# EAGLE design PowerMeasurement (EAGLE 8.2.2)
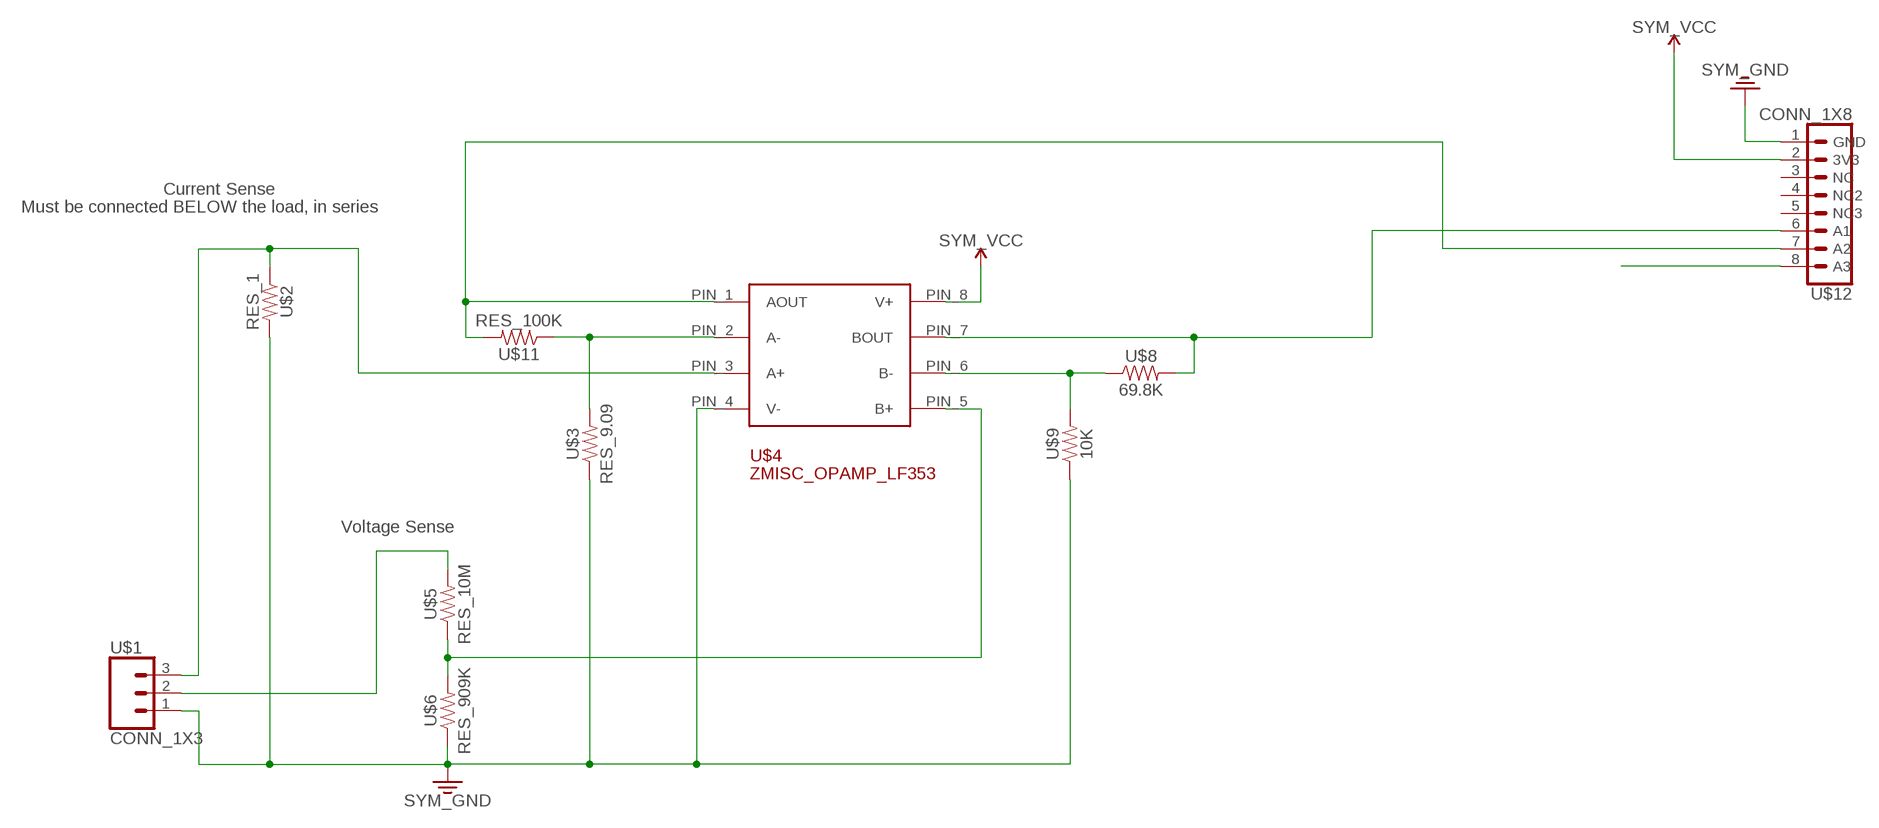
[diagram p0: schematic, sheet 1]

## Parts
U$1  CONN_1X3  [1X03]
U$2  RES_1  [SMD_2512]
U$3  RES_9.09  [SMD_0603]
U$4  ZMISC_OPAMP_LF353  [SOIC-8]
U$5  RES_10M  [SMD_1206]
U$6  RES_909K  [SMD_0805]
U$8  69.8K  RES_69.8K  [SMD_0603]
U$9  10K  RES_10K  [SMD_0603]
U$11  RES_100K  [SMD_0603]
U$12  CONN_1X8  [1X08_LOCK]

## Nets
GND: U$1.1 U$2.P$2 U$3.P$1 U$4.PIN_4(V-) U$6.P$1 U$9.P$1 U$12.1(GND) ; supply symbol labelled SYM_GND
N$1: U$1.3 U$2.P$1 U$4.PIN_3(A+)
N$2: U$12.8(A3)
N$3: U$4.PIN_6(B-) U$8.P$1 U$9.P$2
N$4: U$1.2 U$5.P$2
N$5: U$4.PIN_5(B+) U$5.P$1 U$6.P$2
N$6: U$3.P$2 U$4.PIN_2(A-) U$11.P$1
SCALED_CURRENT_OUT: U$4.PIN_1(AOUT) U$11.P$2 U$12.7(A2)
SCALED_VOLTAGE_OUT: U$4.PIN_7(BOUT) U$8.P$2 U$12.6(A1)
VCC: U$4.PIN_8(V+) U$12.2(3V3) ; supply symbol labelled SYM_VCC
Unconnected: U$12.3(NC) U$12.4(NC2) U$12.5(NC3)

## Notes on the sheet
- Current Sense
- Must be connected BELOW the load, in series
- Voltage Sense

## Library data of the parts
U$1 = PowerMeasurementLBR:CONN_1X3
U$2 = PowerMeasurementLBR:RES_1
U$3 = PowerMeasurementLBR:RES_9.09
U$4 = PowerMeasurementLBR:ZMISC_OPAMP_LF353
U$5 = PowerMeasurementLBR:RES_10M
U$6 = PowerMeasurementLBR:RES_909K
U$8 = PowerMeasurementLBR:RES_69.8K
U$9 = PowerMeasurementLBR:RES_10K
U$11 = PowerMeasurementLBR:RES_100K
U$12 = PowerMeasurementLBR:CONN_1X8

## Board
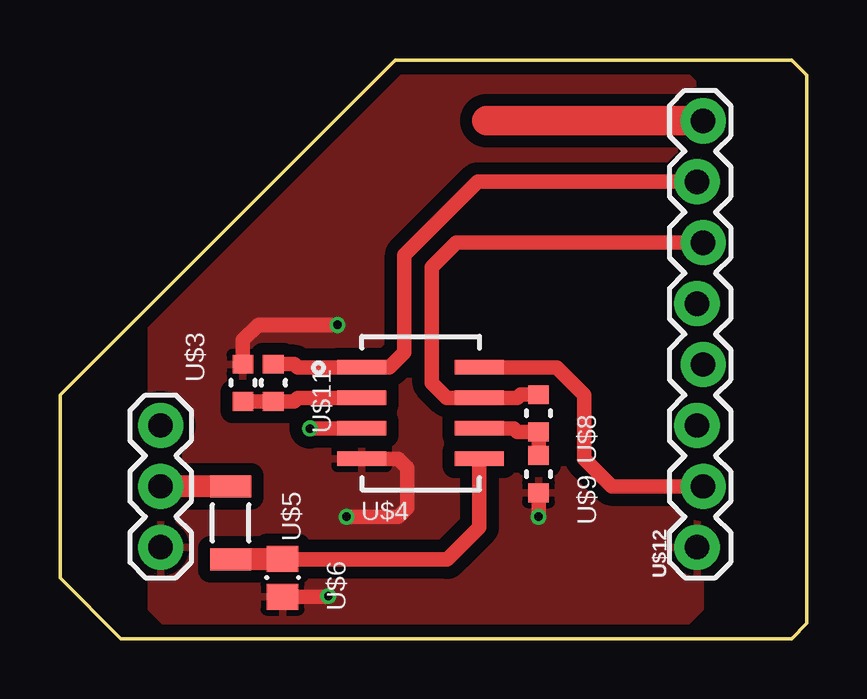
[diagram p1: board, top side]
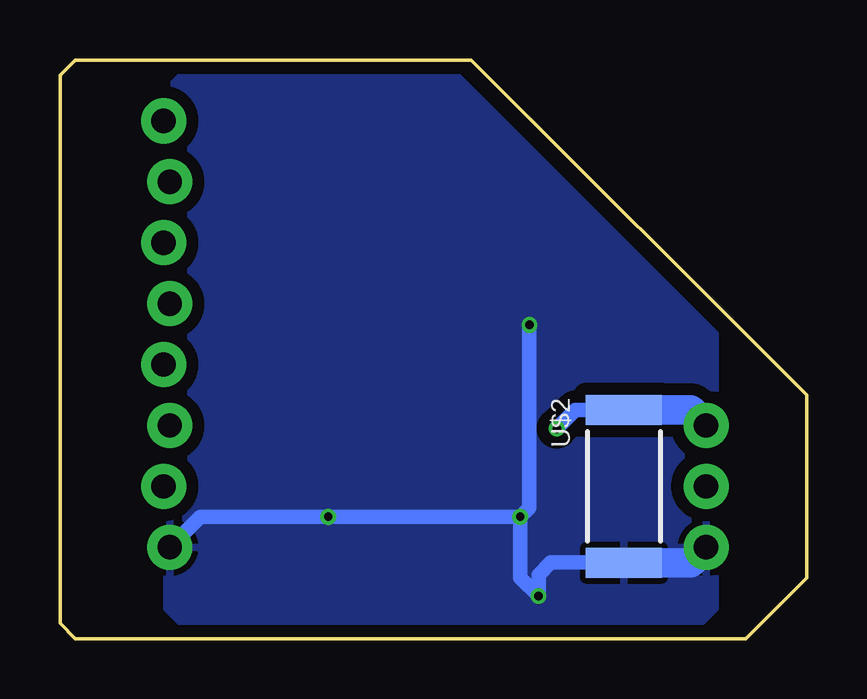
[diagram p2: board, bottom side, seen from below]

Size 31.11 x 24.13 mm. Coordinates in mm from the lower left corner, seen from the top.
Outline: 0,2.54 0,10.16 13.97,24.13 30.48,24.13 31.11,23.5 31.11,0.64 30.48,0 2.54,0 0,2.54
Copper layers (1*16): Top 0.035mm / dielectric 1.5mm / Bottom 0.035mm
Design rules "PowerMeasurement_Seeed_Design_Rules": minimum track width 6mil, minimum drill 12mil, track to track 6mil, track to pad 6mil, pad to pad 6mil, via to via 6mil, smd to smd 0mil, copper to edge 10mil, drill to drill 10mil, minimum pad ring 10mil, minimum via ring 6mil, stop-mask expansion 2mil, vias tented up to drill 100mil, thermal gap 10mil

### Footprints (pad centres in the part's own frame; a part is rotated, then mirrored left to right if it is on the bottom)
1X03 = drill 1.016 pad 1.88: 1 0,0; 2 2.54,0; 3 5.08,0
SMD_2512 = smd 1.245 x 3.175: P$1 -3.188,0; P$2 3.188,0
SMD_0603 = smd 0.787 x 0.864: P$1 -0.774,0; P$2 0.775,0
SOIC-8 = smd 2.03 x 0.61: PIN_1 0,0.01; PIN_2 0,-1.26; PIN_3 0,-2.53; PIN_4 0,-3.8; PIN_5 4.9,-3.8; PIN_6 4.9,-2.53; PIN_7 4.9,-1.26; PIN_8 4.9,0.01
SMD_1206 = smd 0.914 x 1.702: P$1 -1.524,0; P$2 1.524,0
SMD_0805 = smd 1.079 x 1.321: P$1 -0.794,0; P$2 0.794,0
1X08_LOCK = drill 1.016 pad 1.88: 1 0,0.127; 2 2.54,-0.127; 3 5.08,0.127; 4 7.62,-0.127; 5 10.16,0.127; 6 12.7,-0.127; 7 15.24,0.127; 8 17.78,-0.127

### Placement (x,y rotation side)
U$1  4.19,3.81 90 top
U$2  7.62,6.35 270 bottom
U$3  7.62,10.67 270 top
U$4  12.57,11.3 0 top
U$5  7.11,4.83 90 top
U$6  9.27,2.54 90 top
U$8  19.94,9.4 90 top
U$9  19.94,6.86 90 top
U$11  8.89,10.67 90 top
U$12  26.67,3.81 90 top

### Tracks (layer width: path | path; a pad name or v marks a point on that pad's centre or on a via)
GND  (via drill 0.35)
  Top 0.61: U$3.P$1 7.62,12.45 8.26,13.08 v11.56,13.08 | v11.94,5.08 14.1,5.08 14.48,5.46 14.48,7.11 14.1,7.49 12.58,7.49 U$4.PIN_4 | U$9.P$1 v19.94,5.08 | U$6.P$1 11.14,1.75 v11.18,1.78
  Bottom 0.61: v11.56,13.08 11.56,5.46 v11.94,5.08 | v11.94,5.08 v19.94,5.08 25.27,5.08 U$12.1 | U$2.P$2 7.63,3.17 10.67,3.17 11.18,2.67 v11.18,1.78 11.94,2.54 v11.94,5.08
  Bottom 1.219: U$2.P$2 4.84,3.16 U$1.1
  pour Top (isolate 0.508): 3.81,1.27 5.08,0 25.4,0 26.67,1.27 26.67,22.86 25.4,24.13 13.97,24.13 3.81,13.97
  pour Bottom (isolate 0.508): 3.81,1.27 5.08,0 25.4,0 26.67,1.27 26.67,22.86 25.4,24.13 15.24,24.13 3.81,12.7
N$1  (via drill 0.35)
  Top 0.61: U$4.PIN_3 10.42,8.77 v10.41,8.76
  Bottom 0.61: v10.41,8.76 9.64,9.54 U$2.P$1
  Bottom 1.219: U$2.P$1 4.84,9.54 U$1.3
N$2
  Top 1.219: U$12.8 17.78,21.59
N$3
  Top 0.61: U$4.PIN_6 18.91,8.77 19.06,8.62 U$8.P$1 U$9.P$2
N$4
  Top 0.914: U$5.P$2 U$1.2
N$5
  Top 0.61: U$4.PIN_5 17.47,4.65 16.13,3.3 9.24,3.3
  Top 0.914: U$5.P$1 9.24,3.3 U$6.P$2
N$6
  Top 0.61: U$4.PIN_2 9.92,10.04 9.77,9.89 U$11.P$1 U$3.P$2
SCALED_CURRENT_OUT
  Top 0.61: U$11.P$2 9.77,11.44 9.9,11.31 U$4.PIN_1 13.73,11.31 14.35,11.94 14.35,16 17.4,19.05 U$12.7
SCALED_VOLTAGE_OUT
  Top 0.61: U$8.P$2 19.19,10.17 19.06,10.04 U$4.PIN_7 16.12,10.04 15.49,10.67 15.49,15.49 16.51,16.51 U$12.6
VCC
  Top 0.61: U$4.PIN_8 20.69,11.31 21.84,10.16 21.84,7.49 22.99,6.35 U$12.2